# EAGLE schematic 7-segment_mega (EAGLE 6.2)
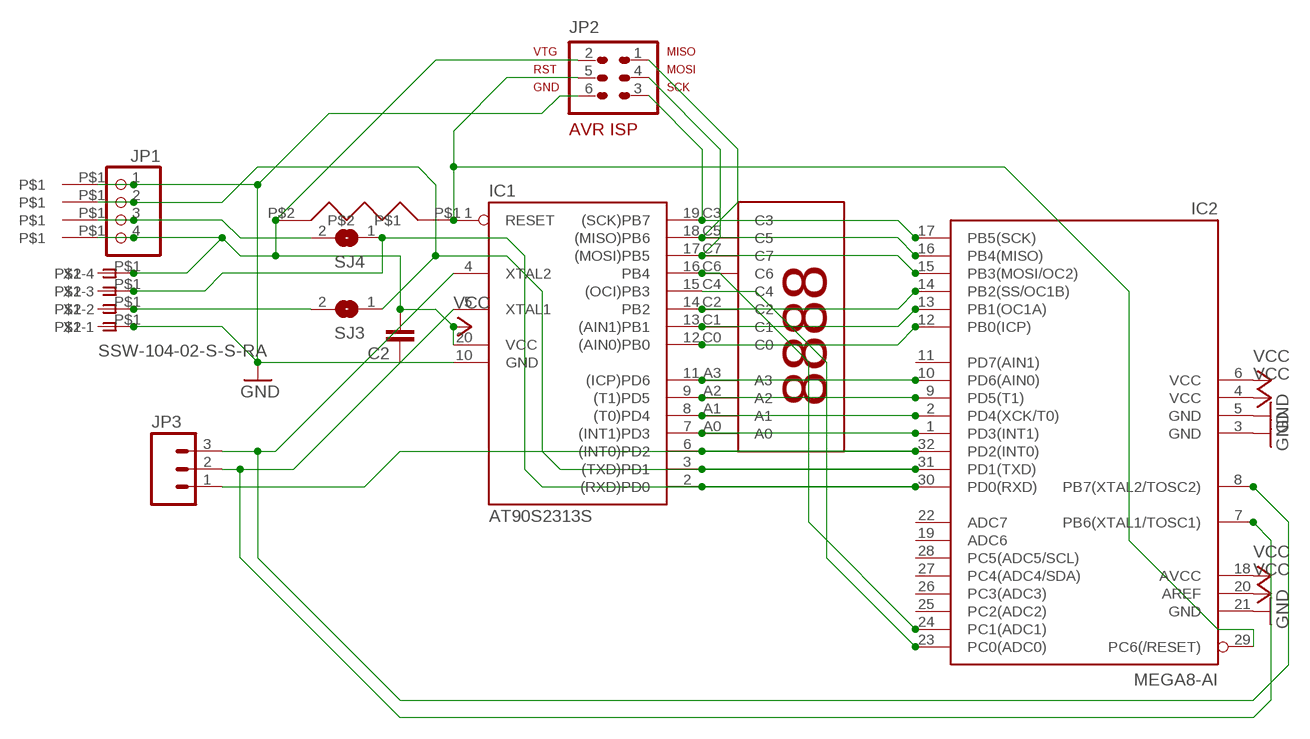
[diagram p0: schematic, sheet 1]

## Parts
C2  CAPPTH  [CAP-PTH-SMALL]
IC1  AT90S2313S  [SO20L]
IC2  MEGA8-AI  [TQFP32-08]
JP1  PINHD-1X4/90  [1X04/90]
JP2  AVR-ISP-6  [AVR-ISP-6]
JP3  M03PTH  [1X03]
SJ3  SJ  [SJ]
SJ4  SJ  [SJ]
U$1  7-SEGMENT-DISPLAY-5462-BS  [7SEG_5462BS]
U$2  R-6  [R-6]
U$3  WIREPAD_SQUARE_1  [WIREPAD_SQUARE_1]
U$4  WIREPAD_SQUARE_1  [WIREPAD_SQUARE_1]
U$5  WIREPAD_SQUARE_1  [WIREPAD_SQUARE_1]
U$6  WIREPAD_SQUARE_1  [WIREPAD_SQUARE_1]
U$7  WIREPAD_SQUARE_1  [WIREPAD_SQUARE_1]
U$8  WIREPAD_SQUARE_1  [WIREPAD_SQUARE_1]
U$9  WIREPAD_SQUARE_1  [WIREPAD_SQUARE_1]
U$10  WIREPAD_SQUARE_1  [WIREPAD_SQUARE_1]
X2  SSW-104-02-S-S-RA  [SSW-104-02-S-S-RA]

## Nets
GND: C2.1 IC1.10(GND) IC2.3(GND) IC2.5(GND) IC2.21(GND) JP1.1 JP2.6 U$3.P$1 U$10.P$1 X2.1
N$1: IC1.14(PB2) IC2.14(PB2(SS/OC1B)) U$1.C2
N$2: IC1.17((MOSI)PB5) IC2.15(PB3(MOSI/OC2)) JP2.4 U$1.C7
N$4: IC1.18((MISO)PB6) IC2.16(PB4(MISO)) JP2.1 U$1.C5
N$5: IC1.19((SCK)PB7) IC2.17(PB5(SCK)) JP2.3 U$1.C3
N$6: IC1.11((ICP)PD6) IC2.10(PD6(AIN0)) U$1.A3
N$7: IC1.7((INT1)PD3) IC2.1(PD3(INT1)) U$1.A0
N$8: IC1.12((AIN0)PB0) IC2.12(PB0(ICP)) U$1.C0
N$10: IC1.8((T0)PD4) IC2.2(PD4(XCK/T0)) U$1.A1
N$11: IC1.9((T1)PD5) IC2.9(PD5(T1)) U$1.A2
N$12: IC1.13((AIN1)PB1) IC2.13(PB1(OC1A)) U$1.C1
N$15: SJ3.2 U$9.P$1 X2.2
N$16: JP1.3 SJ4.2 U$5.P$1
N$17: IC1.2((RXD)PD0) IC2.30(PD0(RXD)) SJ4.1 U$8.P$1 X2.3
N$18: IC1.1(RESET) IC2.29(PC6(/RESET)) JP2.5 U$2.P$1
N$19: IC1.3((TXD)PD1) IC2.31(PD1(TXD)) JP1.2 SJ3.1 U$4.P$1
N$22: IC1.15((OCI)PB3) IC2.23(PC0(ADC0)) U$1.C4
N$23: IC1.16(PB4) IC2.24(PC1(ADC1)) U$1.C6
PD2: IC1.6((INT0)PD2) IC2.32(PD2(INT0)) JP3.1
VCC: C2.2 IC1.20(VCC) IC2.4(VCC) IC2.6(VCC) IC2.18(AVCC) IC2.20(AREF) JP1.4 JP2.2 U$2.P$2 U$6.P$1 U$7.P$1 X2.4
XTAL0: IC1.4(XTAL2) IC2.8(PB7(XTAL2/TOSC2)) JP3.3
XTAL1: IC1.5(XTAL1) IC2.7(PB6(XTAL1/TOSC1)) JP3.2
Unconnected: IC2.11(PD7(AIN1)) IC2.19(ADC6) IC2.22(ADC7) IC2.25(PC2(ADC2)) IC2.26(PC3(ADC3)) IC2.27(PC4(ADC4/SDA)) IC2.28(PC5(ADC5/SCL))

## Library data of the parts
C2 = SparkFun:CAP: Capacitor Standard 0603 ceramic capacitor, and 0.1" leaded capacitor.
IC1 = avr-5-4.16:AT90S2313: MICROCONTROLLER 2 Kbytes FLASH 128 bytes SRAM 128 bytes EEPROM UART
IC2 = atmel:MEGA8: MICROCONTROLLER 8 Kbytes FLASH, 1 kbytes SRAM, 512 bytes EEPROM, USART, 6-channel 10 bit ADC, 2-channel 8 bit ADC Pin compatible with Atmega48, ATMega88, ATMega168 Source: avr.lbr; MPN: ATMEGA8-16AU; OC_FARNELL: 9171371; OC_NEWARK: 73M8863
JP1 = pinhead:PINHD-1X4: PIN HEADER
JP2 = avr-5-4.16:AVR-ISP-6: AVR ISP-6 Serial Programming Header
JP3 = SparkFun:M03: Header 3 Standard 3-pin 0.1" header. Use with straight break away headers (SKU : PRT-00116), right angle break away headers (PRT-00553), swiss pins (PRT-00743), machine pins (PRT-00117), and female headers (PRT-00115). Molex polarized connector foot print use with SKU : PRT-08232 with associated crimp pins and housings.
SJ3 SJ4 = jumper:SJ: SMD solder JUMPER
U$1 = Mrule:7-SEGMENT-DISPLAY-5462-BS
U$2 = Mrule:R-6
U$3-U$10 = Mrule:WIREPAD_SQUARE_1
X2 = con-samtec:SSW-104-02-S-S: THROUGH-HOLE .025" SQ POST SOCKET Source: Samtec SSW.pdf; MPN: SSW-104-02-S-S-RA; OC_FARNELL: unknown; OC_NEWARK: 11P9385